# EAGLE design Component-Tester_v5_1_4 (EAGLE 6.1)
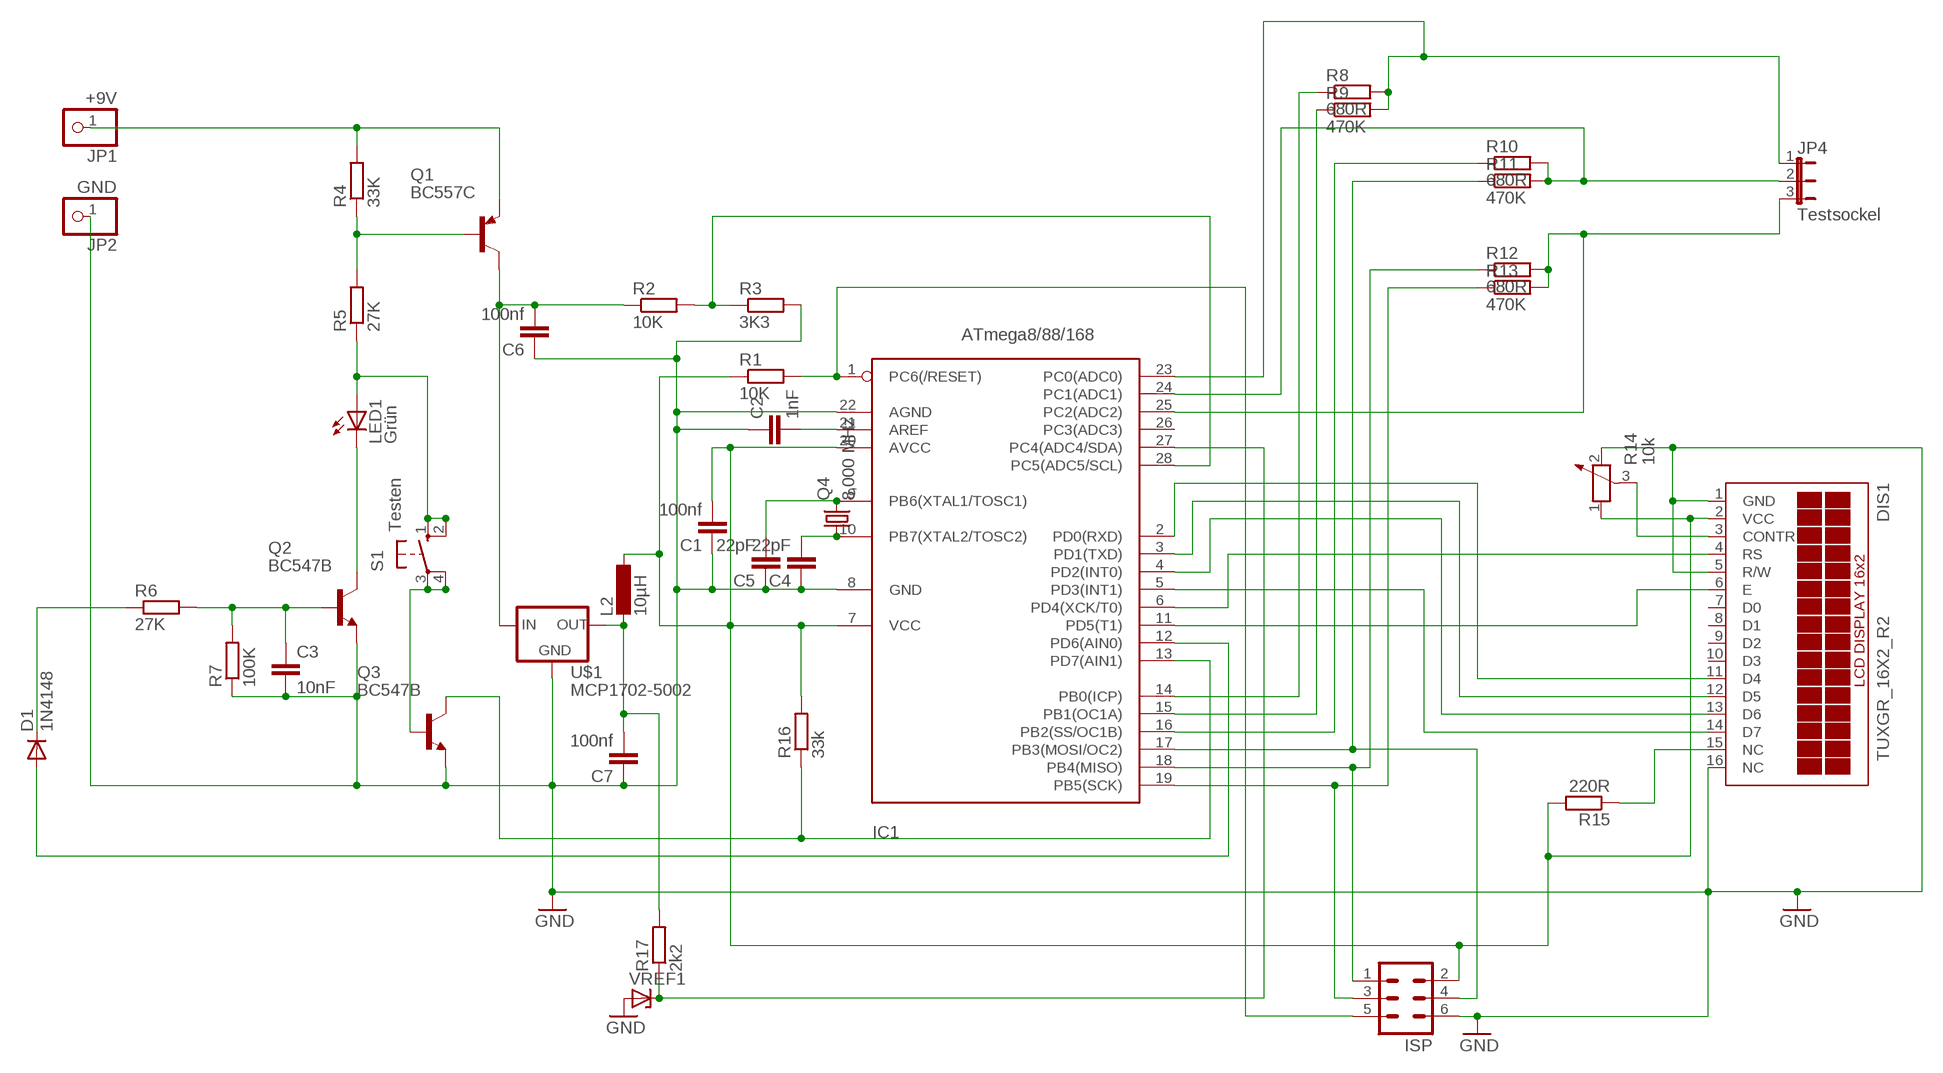
[diagram p0: schematic, sheet 1]

## Parts
C1  100nf  C5/3.5  [C5B3.5]
C2  1nF  C5/3.5  [C5B3.5]
C3  10nF  C5/3.5  [C5B3.5]
C4  22pF  C-EU025-025X050  [C025-025X050]
C5  22pF  C-EU025-025X050  [C025-025X050]
C6  100nf  C5/3.5  [C5B3.5]
C7  100nf  C5/3.5  [C5B3.5]
D1  1N4148  1N4148DO35-7  [DO35-7]
DIS1  TUXGR_16X2_R2  [TUXGR_16X2_R2]
IC1  ATmega8/88/168  MEGA8-P  [DIL28-3]
ISP  ML6L  [ML6L]
JP1  +9V  PINHD-1X1  [1X01]
JP2  GND  PINHD-1X1  [1X01]
JP4  Testsockel  JP2E  [JP2]
L2  10µH  L-EU0207/10  [0207/10]
LED1  Grün  LED5MM  [LED5MM]
Q1  BC557C  [TO92-EBC]
Q2  BC547B  [TO92]
Q3  BC547B  [TO92]
Q4  8,000 MHz  CRYSTALHC49S  [HC49/S]
R1  10K  R-EU_0207/10  [0207/10]
R2  10K  R-EU_0207/10  [0207/10]
R3  3K3  R-EU_0207/10  [0207/10]
R4  33K  R-EU_0207/10  [0207/10]
R5  27K  R-EU_0207/10  [0207/10]
R6  27K  R-EU_0207/10  [0207/10]
R7  100K  R-EU_0207/10  [0207/10]
R8  680R  R-EU_0207/10  [0207/10]
R9  470K  R-EU_0207/10  [0207/10]
R10  680R  R-EU_0207/10  [0207/10]
R11  470K  R-EU_0207/10  [0207/10]
R12  680R  R-EU_0207/10  [0207/10]
R13  470K  R-EU_0207/10  [0207/10]
R14  10k  POTENTIOMETER_PT-10  [PT-10]
R15  220R  R-EU_0207/10  [0207/10]
R16  33k  R-EU_0207/10  [0207/10]
R17  2k2  R-EU_0207/10  [0207/10]
S1  Testen  10-XX  [B3F-10XX]
U$1  MCP1702-5002  [TO92-LOWDROP]
VREF1  LM4040  [TO92-VREF]

## Nets
GND: C1.1 C2.1 C3.2 C4.1 C5.1 C6.1 C7.1 DIS1.1(GND) DIS1.5(R/W) DIS1.16(NC) IC1.8(GND) IC1.22(AGND) ISP.6 JP2.1 Q2.1(E) Q3.1(E) R3.2 R7.1 R14.2 U$1.GND VREF1.-
N$2: C6.2 Q1.C R2.1 U$1.IN
N$3: IC1.1(PC6(/RESET)) ISP.5 R1.2
N$4: C2.2 IC1.21(AREF)
N$5: Q1.B R4.1 R5.2
N$6: IC1.28(PC5(ADC5/SCL)) R2.2 R3.1
N$8: C1.2 DIS1.2(VCC) IC1.7(VCC) IC1.20(AVCC) ISP.2 L2.1 R1.1 R14.1 R15.2 R16.2
N$9: LED1.K(C) Q2.3(C)
N$10: IC1.13(PD7(AIN1)) Q3.3(C) R16.1
N$11: C3.1 Q2.2(B) R6.2 R7.2
N$12: D1.A IC1.12(PD6(AIN0))
N$13: IC1.25(PC2(ADC2)) JP4.3 R12.2 R13.2
N$14: Q3.2(B) S1.3(P) S1.4(P1)
N$15: IC1.24(PC1(ADC1)) JP4.2 R10.2 R11.2
N$16: IC1.23(PC0(ADC0)) JP4.1 R8.2 R9.2
N$17: C7.2 L2.2 R17.2 U$1.OUT
N$18: IC1.18(PB4(MISO)) ISP.1 R12.1
N$19: IC1.14(PB0(ICP)) R8.1
N$20: IC1.15(PB1(OC1A)) R9.1
N$21: IC1.16(PB2(SS/OC1B)) R10.1
N$22: IC1.19(PB5(SCK)) ISP.3 R13.1
N$23: LED1.A R5.1 S1.1(S) S1.2(S1)
N$24: DIS1.3(CONTR) R14.3
N$25: DIS1.4(RS) IC1.6(PD4(XCK/T0))
N$26: DIS1.6(E) IC1.11(PD5(T1))
N$27: DIS1.11(D4) IC1.2(PD0(RXD))
N$28: DIS1.12(D5) IC1.3(PD1(TXD))
N$29: DIS1.13(D6) IC1.4(PD2(INT0))
N$30: DIS1.14(D7) IC1.5(PD3(INT1))
N$31: C4.2 IC1.10(PB7(XTAL2/TOSC2)) Q4.1
N$32: DIS1.15(NC) R15.1
N$33: JP1.1 Q1.E R4.2
N$34: C5.2 IC1.9(PB6(XTAL1/TOSC1)) Q4.2
N$37: D1.C R6.1
N$39: IC1.17(PB3(MOSI/OC2)) ISP.4 R11.1
N$40: IC1.27(PC4(ADC4/SDA)) R17.1 VREF1.+
Unconnected: DIS1.7(D0) DIS1.8(D1) DIS1.9(D2) DIS1.10(D3) IC1.26(PC3(ADC3))

## Library data of the parts
C1-C3 C6 C7 = capacitor-wima:C: CAPACITOR naming: grid - package width
C4 C5 = rcl:C-EU: CAPACITOR, European symbol
D1 = diode:1N4148: DIODE high speed (Philips)
DIS1 = display-lcd:TUXGR_16X2_R2: Tuxgraphics LCD display 16x2 characters reflective, without background light Source: tuxgr_12x2_r2.pdf; OC_FARNELL: unknown; OC_NEWARK: unknown
IC1 = avr-6:MEGA8-P: MICROCONTROLLER 8 Kbytes FLASH 1 kbytes SRAM 512 bytes EEPROM USART 4-channel 10 bit ADC 2-channel 8 bit ADC
ISP = con-ml:ML6L: HARTING; OC_FARNELL: unknown; OC_NEWARK: unknown
JP1 JP2 = pinhead:PINHD-1X1: PIN HEADER
JP4 = jumper:JP2E: JUMPER
L2 = rcl:L-EU: INDUCTOR, European symbol
LED1 = led:LED: LED OSRAM: - CHIPLED LG R971, LG N971, LY N971, LG Q971, LY Q971, LO R971, LY R971 LH N974, LH R974 LS Q976, LO Q976, LY Q976 LO Q996 - Hyper CHIPLED LW Q18S LB Q993, LB Q99A, LB R99A - SideLED LS A670, LO A670, LY A670, LG A670, LP A670 LB A673, LV A673, LT A673, LW A673 LH A674 LY A675 LS A676, LA A676, LO A676, LY A676, LW A676 LS A679, LY A679, LG A679 - Hyper Micro SIDELED® LS Y876, LA Y876, LO Y876, LY Y876 LT Y87S - SmartLED LW L88C, LW L88S LB L89C, LB L89S, LG L890 LS L89K, LO L89K, LY L89K LS L896, LA L896, LO L896, LY L896 - TOPLED LS T670, LO T670, LY T670, LG T670, LP T670 LSG T670, LSP T670, LSY T670, LOP T670, LYG T670 LG T671, LOG T671, LSG T671 LB T673, LV T673, LT T673, LW T673 LH T674 LS T676, LA T676, LO T676, LY T676, LB T676, LH T676, LSB T676, LW T676 LB T67C, LV T67C, LT T67C, LS T67K, LO T67K, LY T67K, LW E67C LS E67B, LA E67B, LO E67B, LY E67B, LB E67C, LV E67C, LT E67C LW T67C LS T679, LY T679, LG T679 LS T770, LO T770, LY T770, LG T770, LP T770 LB T773, LV T773, LT T773, LW T773 LH T774 LS E675, LA E675, LY E675, LS T675 LS T776, LA T776, LO T776, LY T776, LB T776 LHGB T686 LT T68C, LB T68C - Hyper Mini TOPLED® LB M676 - Mini TOPLED Santana® LG M470 LS M47K, LO M47K, LY M47K Source: http://www.osram.convergy.de LUXEON: - LUMILED® LXK2-PW12-R00, LXK2-PW12-S00, LXK2-PW14-U00, LXK2-PW14-V00 LXK2-PM12-R00, LXK2-PM12-S00, LXK2-PM14-U00 LXK2-PE12-Q00, LXK2-PE12-R00, LXK2-PE12-S00, LXK2-PE14-T00, LXK2-PE14-U00 LXK2-PB12-K00, LXK2-PB12-L00, LXK2-PB12-M00, LXK2-PB14-N00, LXK2-PB14-P00, LXK2-PB14-Q00 LXK2-PR12-L00, LXK2-PR12-M00, LXK2-PR14-Q00, LXK2-PR14-R00 LXK2-PD12-Q00, LXK2-PD12-R00, LXK2-PD12-S00 LXK2-PH12-R00, LXK2-PH12-S00 LXK2-PL12-P00, LXK2-PL12-Q00, LXK2-PL12-R00 Source: www.luxeon.com KINGBRIGHT: KA-3528ASYC Source: www.kingbright.com
Q1 = transistor-pnp:BC557*: PNP Transistror
Q2 Q3 = transistor-npn:BC547*: NPN Transistor
Q4 = crystal:CRYSTAL: CRYSTAL; OC_FARNELL: 1667008; OC_NEWARK: unknown
R1-R13 R15-R17 = resistor:R-EU_: RESISTOR, European symbol
R14 = rcl:POTENTIOMETER_: Potentiometer
S1 = switch-omron:10-XX: OMRON SWITCH; MPN: B3F-1000; OC_FARNELL: 176432; OC_NEWARK: 36M3542
U$1 = asko:MCP1702-5002
VREF1 = asko:LM4040

## Net classes
0 default: width 0.406 mm, drill 0.8 mm

## Board
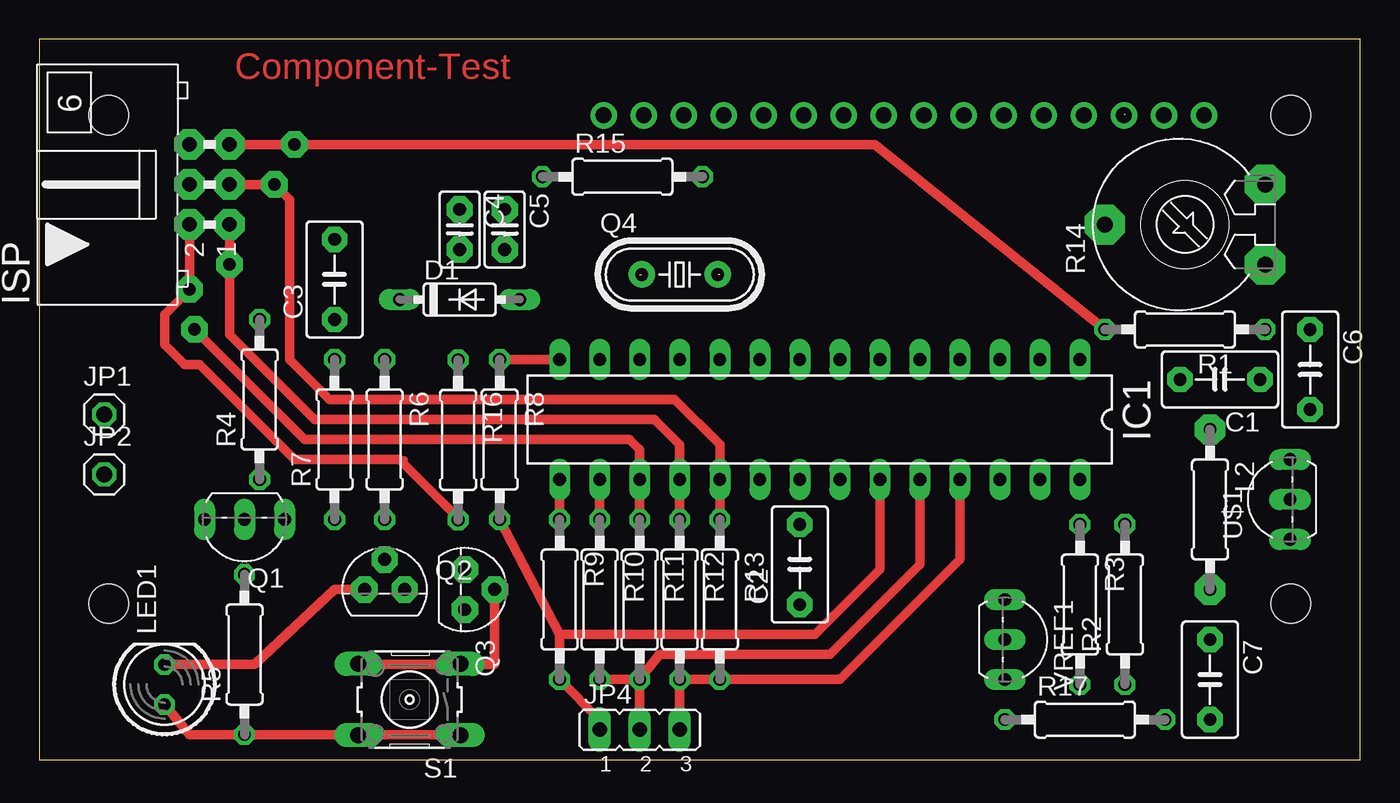
[diagram p1: board, top side]
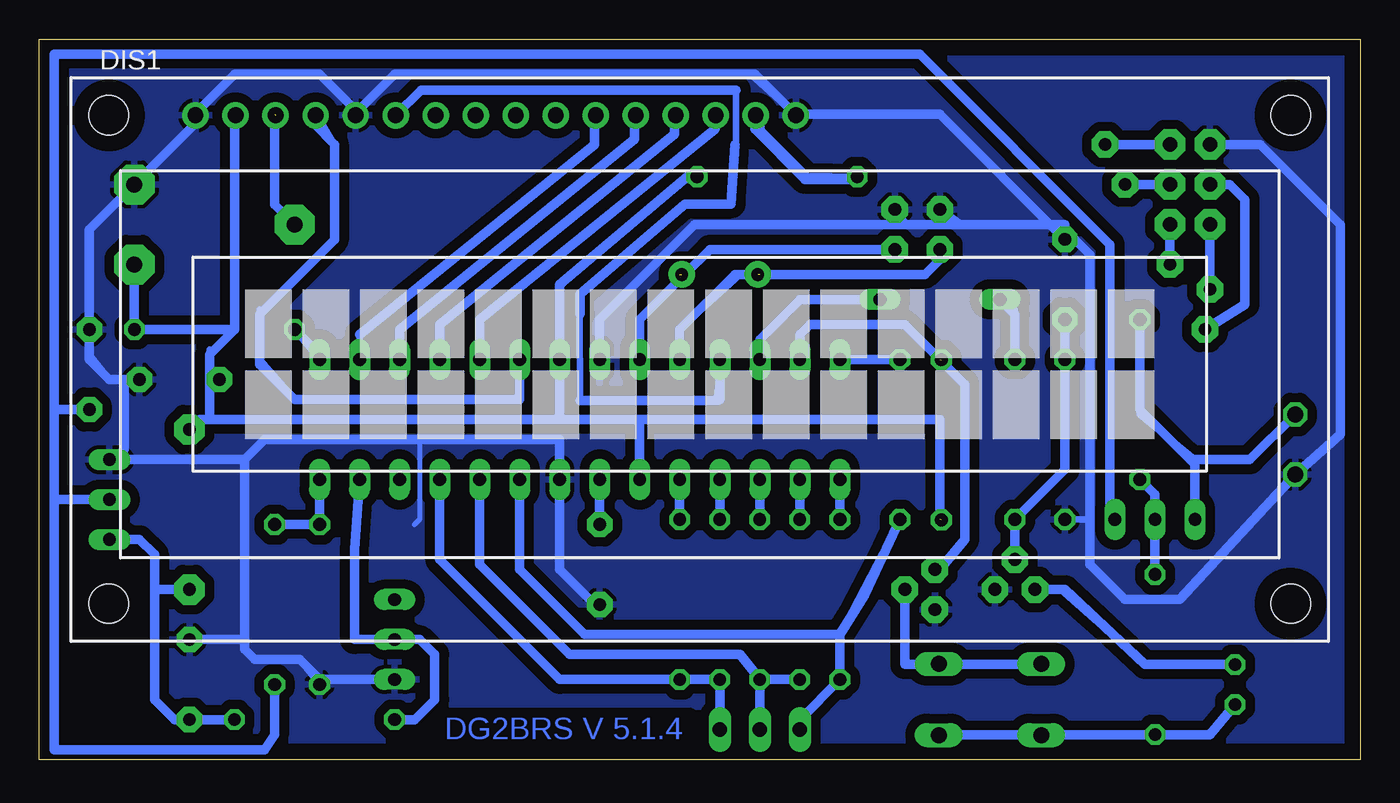
[diagram p2: board, bottom side, seen from below]

Size 83.82 x 45.72 mm. Coordinates in mm from the lower left corner, seen from the top.
Outline: 0,0 83.82,0 83.82,45.72 0,45.72 0,0
Copper layers (1*16): Top 0.035mm / dielectric 1.5mm / Bottom 0.035mm
Design rules "default": minimum track width 10mil, minimum drill 24mil, track to track 8mil, track to pad 8mil, pad to pad 8mil, via to via 8mil, smd to smd 8mil, copper to edge 40mil, drill to drill 8mil, minimum pad ring 10mil, minimum via ring 8mil, stop-mask expansion 4mil, vias tented up to drill 0mil, thermal gap 10mil

### Footprints (pad centres in the part's own frame; a part is rotated, then mirrored left to right if it is on the bottom)
C5B3.5 = drill 0.813 pad 1.6 octagon: 1 -2.54,0; 2 2.54,0
C025-025X050 = drill 0.813 pad 1.676 octagon: 1 -1.27,0; 2 1.27,0
DO35-7 = drill 0.813 long: A 3.81,0; C -3.81,0
TUXGR_16X2_R2 = drill 1 pad 1.676: 1 -32,15.5; 2 -29.46,15.5; 3 -26.92,15.5; 4 -24.38,15.5; 5 -21.84,15.5; 6 -19.3,15.5; 7 -16.76,15.5; 8 -14.22,15.5; 9 -11.68,15.5; 10 -9.14,15.5; 11 -6.6,15.5; 12 -4.06,15.5; 13 -1.52,15.5; 14 1.02,15.5; 15 3.56,15.5; 16 6.1,15.5 | hole 2.5: -37.5,-15.5; 37.5,-15.5; -37.5,15.5; 37.5,15.5
DIL28-3 = drill 0.813 long: 1 -16.51,-3.81; 2 -13.97,-3.81; 3 -11.43,-3.81; 4 -8.89,-3.81; 5 -6.35,-3.81; 6 -3.81,-3.81; 7 -1.27,-3.81; 8 1.27,-3.81; 9 3.81,-3.81; 10 6.35,-3.81; 11 8.89,-3.81; 12 11.43,-3.81; 13 13.97,-3.81; 14 16.51,-3.81; 15 16.51,3.81; 16 13.97,3.81; 17 11.43,3.81; 18 8.89,3.81; 19 6.35,3.81; 20 3.81,3.81; 21 1.27,3.81; 22 -1.27,3.81; 23 -3.81,3.81; 24 -6.35,3.81; 25 -8.89,3.81; 26 -11.43,3.81; 27 -13.97,3.81; 28 -16.51,3.81
ML6L = drill 0.914 pad 1.93 octagon: 1 -2.54,-1.27; 2 -2.54,1.27; 3 0,-1.27; 4 0,1.27; 5 2.54,-1.27; 6 2.54,1.27
1X01 = drill 1.016 octagon: 1 0,0
JP2 = drill 0.914 long: 1 -2.54,0; 2 0,0; 3 2.54,0
0207/10 = drill 0.813 pad 1.93 octagon: 1 -5.08,0; 2 5.08,0
LED5MM = drill 0.813 octagon: A -1.27,0; K 1.27,0
TO92-EBC = drill 0.813 long: B 0,-1.27; C -2.54,-1.27; E 2.54,-1.27
TO92 = drill 0.813 pad 1.676 octagon: 1 1.27,0; 2 0,1.905; 3 -1.27,0
HC49/S = drill 0.813 pad 1.676: 1 -2.413,0; 2 2.413,0
0207/10' = drill 0.813 octagon: 1 -5.08,0; 2 5.08,0
PT-10 = drill 1.016 pad 2.54 octagon: 1 -2.54,-5.08; 2 2.54,-5.08; 3 0,5.08
B3F-10XX = drill 1.016 long: 1 -3.251,2.261; 2 3.251,2.261; 3 -3.251,-2.261; 4 3.251,-2.261
TO92-LOWDROP = drill 0.813 long: GND 1.27,0; IN -1.27,0; OUT -3.81,0
TO92-VREF = drill 0.813 long: + 0,0; - 2.54,0; NC -2.54,0

### Placement (x,y rotation side)
C1  74.93,24.13 180 top
C2  48.26,12.38 90 top
C3  18.73,30.48 90 top
C4  26.67,33.66 270 top
C5  29.53,33.66 270 top
C6  80.64,24.77 270 top
C7  74.3,5.08 270 top
D1  26.67,29.21 0 top
DIS1  41.91,25.4 0 bottom
IC1  49.53,21.59 180 top
ISP  10.79,36.51 90 top
JP1  4.13,21.91 0 top
JP2  4.13,18.1 0 top
JP4  38.1,1.91 0 top
L2  74.3,15.88 270 top
LED1  7.94,4.76 90 top
Q1  13.02,13.97 180 top
Q2  21.91,10.79 0 top
Q3  26.99,10.79 270 top
Q4  40.64,30.8 0 top
R1  10K  [0207/10']  72.71,27.3 180 top
R2  10K  [0207/10']  68.9,9.84 90 top
R3  3K3  [0207/10']  66.04,9.84 270 top
R4  33K  [0207/10']  13.97,22.86 90 top
R5  27K  [0207/10']  13.02,6.67 90 top
R6  27K  [0207/10']  21.91,20.32 270 top
R7  100K  [0207/10']  18.73,20.32 90 top
R8  680R  [0207/10']  29.21,20.32 270 top
R9  470K  [0207/10']  33.02,10.16 270 top
R10  680R  [0207/10']  35.56,10.16 270 top
R11  470K  [0207/10']  38.1,10.16 270 top
R12  680R  [0207/10']  40.64,10.16 270 top
R13  470K  [0207/10']  43.18,10.16 270 top
R14  72.71,33.97 90 top
R15  220R  [0207/10']  37,37 0 top
R16  33k  [0207/10']  26.57,20.3 270 top
R17  2k2  [0207/10']  66.36,2.54 0 top
S1  23.5,3.81 180 top
U$1  79.38,17.78 90 top
VREF1  61.28,7.62 270 top

### Tracks (layer width: path | path; a pad name or v marks a point on that pad's centre or on a via)
GND
  Bottom 0.305: 59.69,20.32 59.69,15.24 60.01,14.92
  Bottom 0.406: 60.96,43.5 38.73,43.5 35.56,40.64 DIS1.16 | 67.31,6.35 R3.2 | 19.05,15.24 R7.1 17.14,15.24 | C6.1 80.64,25.72 79.38,24.13
  Bottom 0.61: 78.42,24.13 79.38,24.13 80.64,25.4 C6.1 80.64,33.66 R14.2 73.98,40.32 73.98,40.96 71.44,43.5 66.04,43.5 63.82,41.27 63.82,40.96 61.28,43.5 38.42,43.5 35.88,40.96 26.67,40.96 C3.2 | 78.42,24.13 C1.1 | 78.42,24.13 78.42,19.68 79.06,19.05 U$1.GND 70.8,19.05 | 70.8,7.62 70.8,6.99 70.17,6.35 67.31,6.35 66.04,5.08 R3.2 65.72,5.08 VREF1.- | 70.8,7.62 70.8,19.05 | C7.1 70.8,7.62 | 70.8,19.05 69.53,20.32 59.69,20.32 50.8,20.32 IC1.22 50.8,12.06 48.58,9.84 C2.1 | IC1.8 48.26,27.94 42.23,33.97 28.89,33.97 | 28.89,33.97 25.4,33.97 | 25.4,33.97 18.73,33.97 C3.2 | C3.2 18.1,33.02 17.14,32.07 17.14,15.24 17.14,12.38 14.92,10.16 11.43,10.16 JP2.1 1.27,20.64 1.27,33.97 6.35,39.05 ISP.6 | C4.1 25.4,33.97 | C5.1 28.89,33.97
  pour Bottom (isolate 0.61): -0.32,46.04 84.14,46.04 84.14,-0.32 -0.32,-0.32
N$1  (via drill 0.8)
  other vias: 4.45,40.96
N$2
  Bottom 0.406: Q1.C 15.88,15.24 15.88,32.7
  Bottom 0.61: 82.87,22.23 82.87,44.77 27.94,44.77 15.88,32.7 15.88,15.56 Q1.C | 82.87,16.51 82.87,0.64 69.53,0.64 68.9,1.59 R2.1 | 82.87,22.23 C6.2 | 82.87,22.23 82.87,16.51 | 82.87,16.51 U$1.IN
N$3  (via drill 0.8 pad 1.68)
  Top 0.61: ISP.5 v16.19,39.05 53.02,39.05 R1.2
  Bottom 0.406: IC1.1 R1.2
  Bottom 0.61: IC1.1 66.04,25.72 R1.2 | v16.19,39.05 ISP.5
N$4
  Bottom 0.61: IC1.21 C2.2
N$5
  Bottom 0.406: R5.2 Q1.B
  Bottom 0.61: R5.2 13.02,16.83 R4.1
N$6
  Bottom 0.61: IC1.28 R3.1 R2.2
N$7  (via drill 0.8)
  other vias: 4.45,9.84
N$8  (via drill 0.8 pad 1.68)  (2 unrouted)
  Top 0.406: 16.19,19.05 23.18,19.05
  Top 0.61: ISP.2 v9.53,29.84 7.94,28.26 7.94,26.35 9.21,25.08 10.16,25.08 16.19,19.05 22.86,19.05 26.67,15.24
  Bottom 0.406: 71.44,27.3 71.44,40.64 DIS1.2 | 42.62,37.08 R15.2 | 73.03,25.72 73.03,26.04 | C1.2 73.03,24.13 | R14.1 77.79,31.75
  Bottom 0.61: 42.62,37.08 50.8,30.16 IC1.7 50.8,21.59 | 45.72,21.59 IC1.20 | 26.67,15.24 26.67,21.59 45.72,21.59 | 45.72,21.59 50.8,21.59 | 50.8,21.59 73.03,21.59 | 73.03,21.59 73.66,21.59 L2.1 | 73.03,21.59 73.03,24.13 73.03,25.72 71.44,27.3 | 71.44,27.3 71.44,40.96 | R14.1 R1.1 71.44,27.3 | ISP.2 v9.53,29.84
N$9
  Top 0.61: Q2.3 18.73,10.79 13.65,6.03 LED1.K
  Bottom 0.406: 13.65,6.03 19.05,10.79 Q2.3
  Bottom 0.61: Q2.3 18.73,10.79 13.65,6.03 LED1.K
N$10  (1 unrouted)
  Bottom 0.61: Q3.3 26.67,12.06 25.08,13.97 25.08,23.81 26.67,25.4 28.89,27.62 34.92,27.62 35.56,26.99 IC1.13
N$11
  Bottom 0.406: C3.1 R7.2 18.73,18.41
  Bottom 0.61: Q2.2 R6.2 18.73,18.41 C3.1
N$12
  Bottom 0.61: D1.A 35.56,29.21 38.1,26.67 IC1.12
N$13
  Top 0.406: IC1.25 58.42,13.97
  Top 0.61: JP4.3 R12.2 R13.2 50.8,5.08 58.42,12.7 IC1.25
  Bottom 0.61: JP4.3 R12.2 R13.2 50.8,5.08 58.42,12.7 IC1.25
N$14
  Top 0.61: Q3.2 28.89,6.03 20.32,6.03
  Bottom 0.406: 28.89,6.03 S1.4 20.64,6.03 20.32,6.03 20,6.03 S1.3
  Bottom 0.61: 20.32,6.03 28.89,6.03 Q3.2
N$15
  Top 0.406: IC1.24 55.88,13.34
  Top 0.61: R10.2 R11.2 | R11.2 JP4.2 | R11.2 39.37,6.67 50.16,6.67 55.88,12.38 IC1.24
  Bottom 0.61: R10.2 R11.2 | R11.2 JP4.2 | R11.2 39.37,6.67 50.16,6.67 55.88,12.38 IC1.24
N$16
  Top 0.406: 35.56,2.54 JP4.1
  Top 0.61: 35.56,2.54 R9.2 33.02,7.94 | R8.2 33.02,7.94 | 33.02,7.94 49.21,7.94 53.34,12.06 IC1.23
  Bottom 0.406: 33.02,7.94 R8.2
  Bottom 0.61: 33.02,7.94 49.21,7.94 53.34,12.06 IC1.23 | JP4.1 35.56,2.54 R9.2 33.02,7.94 | 33.02,7.94 31.43,10.48 R8.2
N$17
  Bottom 0.61: 76.52,10.79 76.52,3.81 75.25,2.54 C7.2 R17.2 | U$1.OUT 77.47,13.97 76.52,13.02 76.52,10.79 | 76.52,10.79 L2.2
N$18  (via drill 0.8 pad 1.68)
  Top 0.61: R12.1 IC1.18 40.64,20 39.05,21.59 17.46,21.59 12.06,26.99 v12.06,31.43 ISP.1
  Bottom 0.61: IC1.18 R12.1 | ISP.1 v12.06,31.43
N$19
  Top 0.61: IC1.14 R8.1
  Bottom 0.61: IC1.14 R8.1
N$20
  Top 0.61: IC1.15 R9.1
  Bottom 0.61: IC1.15 R9.1
N$21
  Top 0.61: IC1.16 R10.1
  Bottom 0.61: IC1.16 R10.1
N$22  (via drill 0.8 pad 1.68)
  Top 0.61: R13.1 IC1.19 43.18,20 40.32,22.86 18.41,22.86 15.88,25.4 15.88,35.56 v14.92,36.51 ISP.3
  Bottom 0.61: IC1.19 R13.1 | ISP.3 v14.92,36.51
N$23
  Top 0.61: 26.67,1.59 R5.1 9.53,1.59 LED1.A
  Bottom 0.406: 16.51,1.59 R5.1 9.53,1.59 | 16.51,1.59 21.27,1.59 S1.2 | S1.1 16.51,1.59
  Bottom 0.61: 26.67,1.59 9.53,1.59 LED1.A
N$24  (1 unrouted)
  Bottom 0.61: R14.3 68.9,35.24 68.9,40.96
N$25
  Bottom 0.406: 67.63,22.86 69.85,25.4 69.85,28.26 69.85,28.57 | 65.09,39.05 66.04,40.64 DIS1.4
  Bottom 0.61: 66.36,40.96 66.36,40.32 65.09,39.05 65.09,33.02 69.85,28.26 69.85,25.08 67.63,22.86 53.34,22.86 IC1.6
N$26
  Bottom 0.406: 40.64,23.86 IC1.11 | 49.5,22.8 49.53,28.26 49.5,28.29 | 39.69,39.05 39.6,39.14 39.6,42.5
  Bottom 0.61: 40.64,23.86 40.75,22.8 49.5,22.8 | 49.5,28.29 49.5,29.57 42.84,35.27 39.92,35.27 39.69,39.05 | 39.6,42.5 59.61,42.5 DIS1.6 | IC1.11 40.64,22.86
N$27
  Bottom 0.406: 63.5,26.99 IC1.2 | DIS1.11 48.58,39.05
  Bottom 0.61: 63.5,26.99 48.58,39.05 48.58,40.96
N$28
  Bottom 0.406: DIS1.12 46.04,39.37
  Bottom 0.61: IC1.3 60.96,27.3 46.04,39.37 46.04,40.96
N$29
  Bottom 0.406: DIS1.13 43.5,39.69
  Bottom 0.61: IC1.4 58.42,27.62 43.5,39.69 43.5,40.96
N$30
  Bottom 0.406: DIS1.14 40.96,40.01
  Bottom 0.61: IC1.5 55.88,27.94 40.96,40.01 40.96,40.96
N$31  (1 unrouted)
  Bottom 0.406: 43.18,27.3 39.69,30.48 39.37,30.8
  Bottom 0.61: C4.2 26.67,31.75 27.62,30.8 38.1,30.8 39.37,30.8 39.69,30.8 43.18,27.3 IC1.10
N$32
  Bottom 0.406: R15.1 35.08,37.08 38,40 38,40.55 DIS1.15
N$33
  Bottom 0.406: Q1.E 10.48,19.05 13.97,21.91 13.97,22.23
  Bottom 0.61: Q1.E 10.48,18.73 13.97,22.23 R4.2 | 10.48,19.05 6.99,19.05 JP1.1
N$34  (1 unrouted)
  Bottom 0.61: C5.2 41.27,32.38 42.86,30.8 | 42.86,30.8 45.72,27.94 IC1.9 | 43.18,30.8 42.86,30.8
N$35  (via drill 0.8)
  other vias: 79.38,9.84
N$36  (via drill 0.8)
  other vias: 79.38,40.96
N$37
  Bottom 0.406: D1.C 21.91,28.57 R6.1
  Bottom 0.61: R6.1 21.91,28.26 D1.C
N$38
  Bottom 0.61: 31.75,36.83 35.24,36.83 38.42,40.01 38.42,40.96
N$39  (via drill 0.8 pad 1.68)
  Top 0.61: R11.1 IC1.17 38.1,19.68 37.47,20.32 16.83,20.32 v9.84,27.3
  Bottom 0.61: IC1.17 R11.1 | ISP.4 8.26,36.51 7.3,35.56 7.3,28.89 v9.84,27.3
N$40
  Bottom 0.61: IC1.27 63.82,13.34 63.82,7.62 VREF1.+ 59.69,7.62 58.74,6.67 58.74,3.81 60.01,2.54 R17.1

### Text on the board
Top: Component-Test
Bottom: DG2BRS V 5.1.4